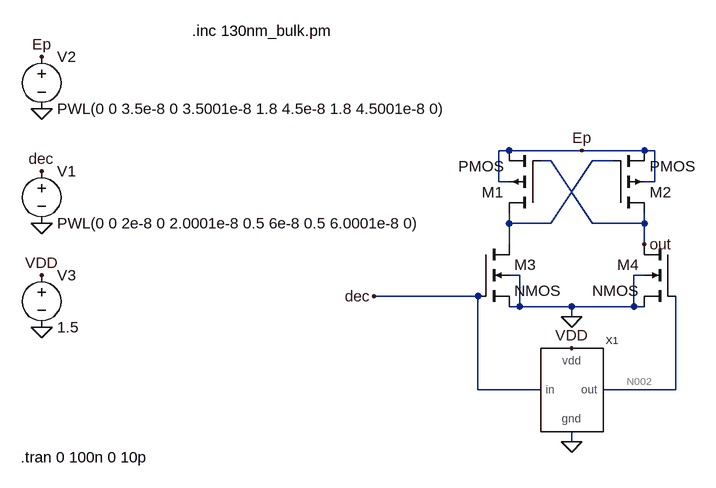
[diagram p0: schematic decoder_amplifaer.asc]
decoder_amplifaer.asc, the LTspice schematic file:
Version 4
SHEET 1 880 680
WIRE 64 32 48 32
WIRE 176 32 64 32
WIRE 272 32 176 32
WIRE 288 32 272 32
WIRE 128 48 112 48
WIRE 224 48 192 48
WIRE 48 80 48 32
WIRE 64 80 48 80
WIRE 288 80 288 32
WIRE 288 80 272 80
WIRE 64 144 64 128
WIRE 128 144 192 48
WIRE 128 144 64 144
WIRE 192 144 128 48
WIRE 272 144 272 128
WIRE 272 144 192 144
WIRE 64 176 64 144
WIRE 272 176 272 144
WIRE 80 224 64 224
WIRE 272 224 256 224
WIRE 16 256 -144 256
WIRE 80 272 80 224
WIRE 80 272 64 272
WIRE 160 272 80 272
WIRE 256 272 256 224
WIRE 256 272 160 272
WIRE 272 272 256 272
WIRE 160 288 160 272
WIRE 16 400 16 256
WIRE 112 400 16 400
WIRE 320 400 320 256
WIRE 320 400 208 400
WIRE 160 480 160 464
FLAG 160 288 0
FLAG 160 480 0
FLAG 176 32 Ep
FLAG 160 336 VDD
FLAG 272 176 out
FLAG -656 144 0
FLAG -656 -32 0
FLAG -656 -112 Ep
FLAG -656 64 dec
FLAG -144 256 dec
FLAG -656 304 0
FLAG -656 224 VDD
SYMBOL pmos4 112 128 R180
SYMATTR InstName M1
SYMATTR Value2 l=260e-9 w=2600e-9 ad=676000e-18 as=676000e-18 pd=3640e-9 ps=3640e-9
SYMBOL pmos4 224 128 M180
SYMATTR InstName M2
SYMATTR Value2 l=260e-9 w=2600e-9 ad=676000e-18 as=676000e-18 pd=3640e-9 ps=3640e-9
SYMBOL nmos4 16 176 R0
SYMATTR InstName M3
SYMATTR Value2 l=130e-9 w=1300e-9 ad=676000e-18 as=676000e-18 pd=3640e-9 ps=3640e-9
SYMBOL nmos4 320 176 M0
SYMATTR InstName M4
SYMATTR Value2 l=130e-9 w=1300e-9 ad=676000e-18 as=676000e-18 pd=3640e-9 ps=3640e-9
SYMBOL invert 160 400 R0
SYMATTR InstName X1
SYMBOL voltage -656 48 R0
WINDOW 123 0 0 Left 0
WINDOW 39 0 0 Left 0
SYMATTR InstName V1
SYMATTR Value PWL(0 0 2e-8 0 2.0001e-8 0.5 6e-8 0.5 6.0001e-8 0)
SYMBOL voltage -656 -128 R0
WINDOW 123 0 0 Left 0
WINDOW 39 0 0 Left 0
SYMATTR InstName V2
SYMATTR Value PWL(0 0 3.5e-8 0 3.5001e-8 1.8 4.5e-8 1.8 4.5001e-8 0)
SYMBOL voltage -656 208 R0
WINDOW 123 0 0 Left 0
WINDOW 39 0 0 Left 0
SYMATTR InstName V3
SYMATTR Value 1.5
TEXT -424 -152 Left 2 !.inc 130nm_bulk.pm
TEXT -688 504 Left 2 !.tran 0 100n 0 10p

The netlist it stands for:
* decoder_amplifaer.asc
M1 N001 out Ep Ep PMOS l=260e-9 w=2600e-9 ad=676000e-18 as=676000e-18 pd=3640e-9 ps=3640e-9
M2 out N001 Ep Ep PMOS l=260e-9 w=2600e-9 ad=676000e-18 as=676000e-18 pd=3640e-9 ps=3640e-9
M3 N001 dec 0 0 NMOS l=130e-9 w=1300e-9 ad=676000e-18 as=676000e-18 pd=3640e-9 ps=3640e-9
M4 out N002 0 0 NMOS l=130e-9 w=1300e-9 ad=676000e-18 as=676000e-18 pd=3640e-9 ps=3640e-9
XX1 dec VDD 0 N002 invert  ; pins in vdd gnd out
V1 dec 0 PWL(0 0 2e-8 0 2.0001e-8 0.5 6e-8 0.5 6.0001e-8 0)
V2 Ep 0 PWL(0 0 3.5e-8 0 3.5001e-8 1.8 4.5e-8 1.8 4.5001e-8 0)
V3 VDD 0 1.5
.model NMOS NMOS
.model PMOS PMOS
.lib standard.mos
.inc 130nm_bulk.pm
.tran 0 100n 0 10p
.backanno
.end

* Results of the author's LTspice run, read from the files saved beside the schematic
* Operating Point, zero values left out:
*   V(out) = 3.158 µV
*   V(n002) = 1.5 V
*   V(vdd) = 1.5 V
*   Ig(M4) = 27.65 nA
*   Ib(M4) = -30.69 pA
*   Is(M4) = -27.62 nA
*   I(V3) = -87.56 nA
*   I(V1) = 5.967 nA
*   Ix(x1:IN) = -5.967 nA
*   Ix(x1:VDD) = 87.56 nA
*   Ix(x1:GND) = -53.94 nA
*   Ix(x1:OUT) = -27.65 nA
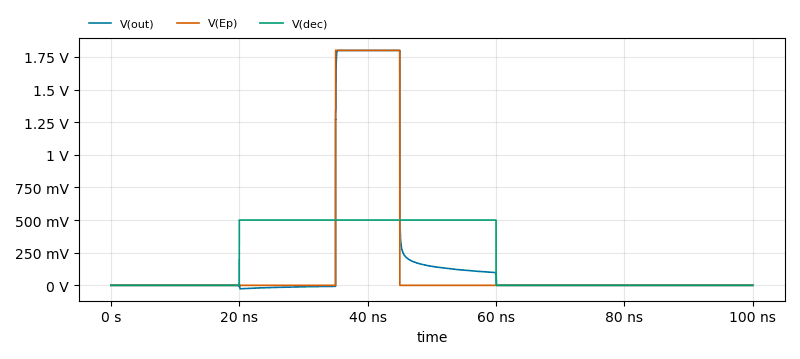
[diagram p1: Transient Analysis of decoder_amplifaer.asc, plotted from the saved traces]
* Transient Analysis, 1 run:
*   V(out): min -26.58 mV, max 1.799 V, average 198.8 mV, rms 571 mV, last 3.429 µV
*   V(Ep): min 0 V, max 1.8 V, average 180 mV, rms 569.2 mV, last 0 V
*   V(dec): min 0 V, max 500 mV, average 200 mV, rms 316.2 mV, last 0 V